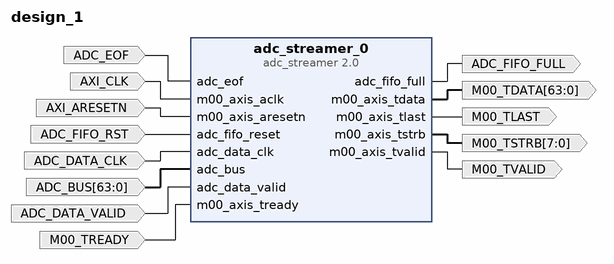
[diagram p0: block diagram of the top level]
# Vivado block design design_1, xc7z014sclg400-1, Vivado 2018.3
create_bd_design design_1

create_bd_port -dir I -from 63 -to 0 ADC_BUS
create_bd_port -dir I ADC_EOF
create_bd_port -dir I -type clk AXI_CLK
set_property -dict {CONFIG.FREQ_HZ 200000000} [get_bd_ports AXI_CLK]
create_bd_port -dir I AXI_ARESETN
create_bd_port -dir I ADC_FIFO_RST
create_bd_port -dir I ADC_DATA_CLK
create_bd_port -dir I ADC_DATA_VALID
create_bd_port -dir O -from 63 -to 0 M00_TDATA
create_bd_port -dir O -from 7 -to 0 M00_TSTRB
create_bd_port -dir O M00_TLAST
create_bd_port -dir O M00_TVALID
create_bd_port -dir I M00_TREADY
create_bd_port -dir O ADC_FIFO_FULL

create_bd_cell -type ip -vlnv xilinx.com:user:adc_streamer:2.0 adc_streamer_0

# ---- connections ----

connect_bd_net [get_bd_ports ADC_EOF] [get_bd_pins adc_streamer_0/adc_eof]
connect_bd_net [get_bd_ports AXI_CLK] [get_bd_pins adc_streamer_0/m00_axis_aclk]
connect_bd_net [get_bd_ports AXI_ARESETN] [get_bd_pins adc_streamer_0/m00_axis_aresetn]
connect_bd_net -net AXI_FIFO_RST_1 [get_bd_ports ADC_FIFO_RST] [get_bd_pins adc_streamer_0/adc_fifo_reset]
connect_bd_net [get_bd_ports ADC_DATA_CLK] [get_bd_pins adc_streamer_0/adc_data_clk]
connect_bd_net [get_bd_ports ADC_BUS] [get_bd_pins adc_streamer_0/adc_bus]
connect_bd_net [get_bd_ports ADC_DATA_VALID] [get_bd_pins adc_streamer_0/adc_data_valid]
connect_bd_net [get_bd_pins adc_streamer_0/m00_axis_tdata] [get_bd_ports M00_TDATA]
connect_bd_net [get_bd_pins adc_streamer_0/m00_axis_tstrb] [get_bd_ports M00_TSTRB]
connect_bd_net [get_bd_ports M00_TREADY] [get_bd_pins adc_streamer_0/m00_axis_tready]
connect_bd_net [get_bd_pins adc_streamer_0/m00_axis_tvalid] [get_bd_ports M00_TVALID]
connect_bd_net [get_bd_pins adc_streamer_0/m00_axis_tlast] [get_bd_ports M00_TLAST]
connect_bd_net [get_bd_pins adc_streamer_0/adc_fifo_full] [get_bd_ports ADC_FIFO_FULL]

validate_bd_design
save_bd_design
